# EAGLE design nano_board_v0 (EAGLE 9.6.2)
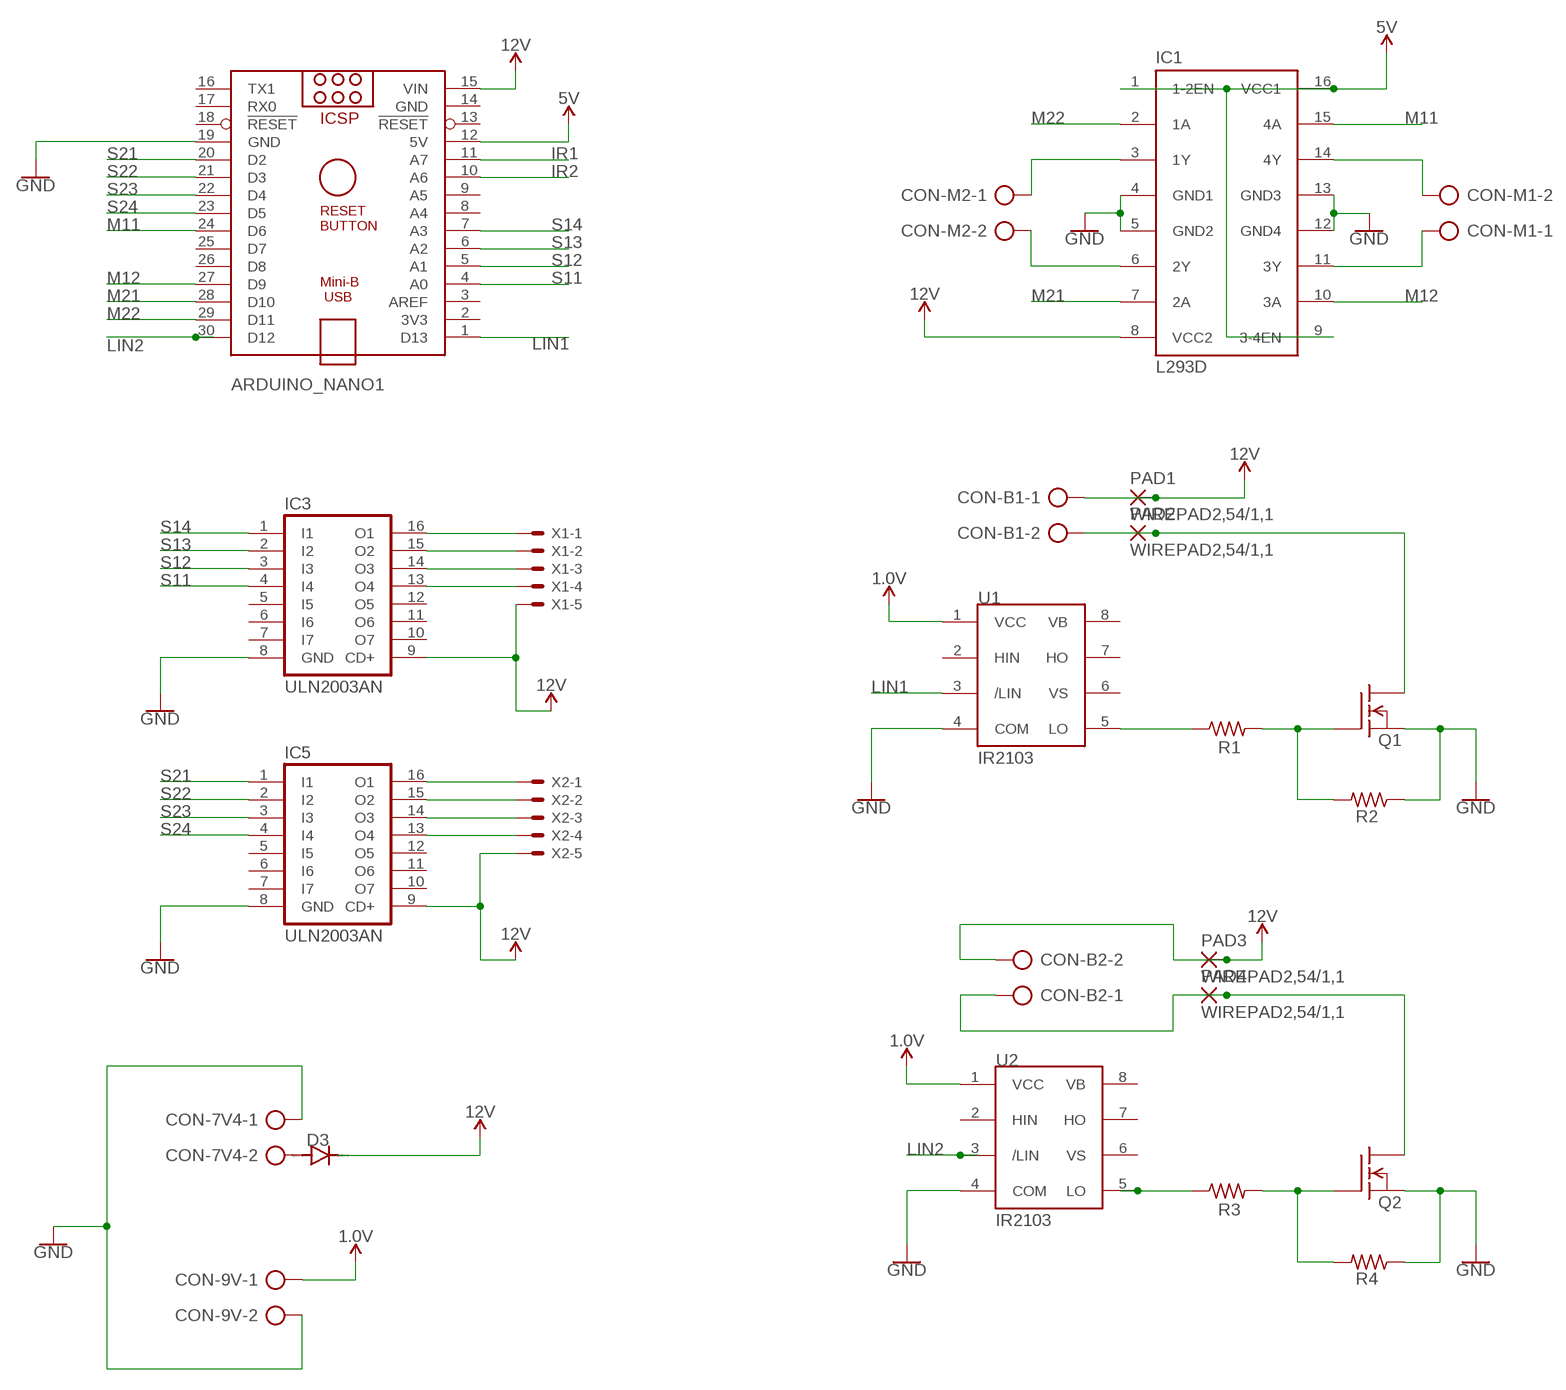
[diagram p0: schematic, sheet 1]

## Parts
ARDUINO_NANO1  ARDUINO_NANO  [ARDUINO_NANO]
CON-7V4  AK500/2  [AK500/2]
CON-9V  AK500/2  [AK500/2]
CON-B1  AK500/2  [AK500/2]
CON-B2  AK500/2  [AK500/2]
CON-M1  AK500/2  [AK500/2]
CON-M2  AK500/2  [AK500/2]
D3  1N4004  [DO41-10]
IC1  L293D  [DIL16]
IC3  ULN2003AN  [DIL16]
IC5  ULN2003AN  [DIL16]
PAD1  WIREPAD2,54/1,1  [2,54/1,1]
PAD2  WIREPAD2,54/1,1  [2,54/1,1]
PAD3  WIREPAD2,54/1,1  [2,54/1,1]
PAD4  WIREPAD2,54/1,1  [2,54/1,1]
Q1  IRF510  [TO220]
Q2  IRF510  [TO220]
R1  R-US_0204/7  [0204/7]
R2  R-US_0204/7  [0204/7]
R3  R-US_0204/7  [0204/7]
R4  R-US_0204/7  [0204/7]
U1  IR2103  [DIL08]
U2  IR2103  [DIL08]
X1  JST-XH-05-PIN-LONG-PAD  [JST-XH-05-PACKAGE-LONG-PAD]
X2  JST-XH-05-PIN-LONG-PAD  [JST-XH-05-PACKAGE-LONG-PAD]

## Nets
1.0V: CON-9V.1 U1.1(VCC) U2.1(VCC)
5V: ARDUINO_NANO1.12(5V) IC1.1(1-2EN) IC1.9(3-4EN) IC1.16(VCC1)
12V: ARDUINO_NANO1.15(VIN) CON-B1.1 CON-B2.2 D3.C IC1.8(VCC2) IC3.9(CD+) IC5.9(CD+) PAD1.1(P) PAD3.1(P) X1.5 X2.5
GND: ARDUINO_NANO1.19(GND) CON-7V4.1 CON-9V.2 IC1.4(GND1) IC1.5(GND2) IC1.12(GND4) IC1.13(GND3) IC3.8(GND) IC5.8(GND) Q1.3(S) Q2.3(S) R2.1 R4.1 U1.4(COM) U2.4(COM)
IR1: ARDUINO_NANO1.11(A7)
IR2: ARDUINO_NANO1.10(A6)
LIN1: ARDUINO_NANO1.1(D13) U1.3(/LIN)
LIN2: ARDUINO_NANO1.30(D12) U2.3(/LIN)
M11: ARDUINO_NANO1.24(D6) IC1.15(4A)
M12: ARDUINO_NANO1.27(D9) IC1.10(3A)
M21: ARDUINO_NANO1.28(D10) IC1.7(2A)
M22: ARDUINO_NANO1.29(D11) IC1.2(1A)
N$1: R1.1 U1.5(LO)
N$2: Q1.1(G) R1.2 R2.2
N$3: R3.1 U2.5(LO)
N$4: IC3.16(O1) X1.1
N$5: IC3.15(O2) X1.2
N$6: CON-M1.2 IC1.14(4Y)
N$7: CON-M1.1 IC1.11(3Y)
N$8: CON-M2.1 IC1.3(1Y)
N$9: CON-M2.2 IC1.6(2Y)
N$10: CON-B1.2 PAD2.1(P) Q1.2(D)
N$11: Q2.1(G) R3.2 R4.2
N$12: IC3.14(O3) X1.3
N$13: IC3.13(O4) X1.4
N$14: IC5.16(O1) X2.1
N$15: IC5.15(O2) X2.2
N$16: CON-B2.1 PAD4.1(P) Q2.2(D)
N$17: CON-7V4.2 D3.A
N$19: IC5.14(O3) X2.3
N$20: IC5.13(O4) X2.4
S11: ARDUINO_NANO1.4(A0) IC3.4(I4)
S12: ARDUINO_NANO1.5(A1) IC3.3(I3)
S13: ARDUINO_NANO1.6(A2) IC3.2(I2)
S14: ARDUINO_NANO1.7(A3) IC3.1(I1)
S21: ARDUINO_NANO1.20(D2) IC5.1(I1)
S22: ARDUINO_NANO1.21(D3) IC5.2(I2)
S23: ARDUINO_NANO1.22(D4) IC5.3(I3)
S24: ARDUINO_NANO1.23(D5) IC5.4(I4)
Unconnected: ARDUINO_NANO1.2(3V3) ARDUINO_NANO1.3(AREF) ARDUINO_NANO1.8(A4) ARDUINO_NANO1.9(A5) ARDUINO_NANO1.13(!RESET) ARDUINO_NANO1.16(TX1) ARDUINO_NANO1.17(RX0) ARDUINO_NANO1.18(!RESET) ARDUINO_NANO1.25(D7) ARDUINO_NANO1.26(D8) IC3.5(I5) IC3.6(I6) IC3.7(I7) IC3.10(O7) IC3.11(O6) IC3.12(O5) IC5.5(I5) IC5.6(I6) IC5.7(I7) IC5.10(O7) IC5.11(O6) IC5.12(O5) U1.2(HIN) U1.6(VS) U1.7(HO) U1.8(VB) U2.2(HIN) U2.6(VS) U2.7(HO) U2.8(VB)

## Power pins joined to a net without a drawn wire
GND: ARDUINO_NANO1.14(GND)

## Library data of the parts
ARDUINO_NANO1 = ArduinoNanoV30:ARDUINO_NANO: Arduino Nano V3.0 Overview: The Arduino Nano is a small, complete, and breadboard-friendly board based on the ATmega328 (Arduino Nano 3.x) or ATmega168 (Arduino Nano 2.x). It has more or less the same functionality of the Arduino Duemilanove, but in a different package. It lacks only a DC power jack, and works with a Mini-B USB cable instead of a standard one. The Nano was designed and is being produced by Gravitech. Specifications: Microcontroller Atmel ATmega168 or ATmega328 Operating Voltage (logic level) 5 V Input Voltage (recommended) 7-12 V Input Voltage (limits) 6-20 V Digital I/O Pins 14 (of which 6 provide PWM output) Analog Input Pins 8 DC Current per I/O Pin 40 mA Flash Memory 16 KB (ATmega168) or 32 KB (ATmega328) of which 2 KB used by bootloader SRAM 1 KB (ATmega168) or 2 KB (ATmega328) EEPROM 512 bytes (ATmega168) or 1 KB (ATmega328) Clock Speed 16 MHz Dimensions 0.73" x 1.70" Length 45 mm Width 18 mm Weigth 5 g Power: The Arduino Nano can be powered via the Mini-B USB connection, 6-20V unregulated external power supply (pin 30), or 5V regulated external power supply (pin 27). The power source is automatically selected to the highest voltage source. Memory: The ATmega168 has 16 KB of flash memory for storing code (of which 2 KB is used for the bootloader); the ATmega328 has 32 KB, (also with 2 KB used for the bootloader). The ATmega168 has 1 KB of SRAM and 512 bytes of EEPROM (which can be read and written with the EEPROM library); the ATmega328 has 2 KB of SRAM and 1 KB of EEPROM. Input and Output: Each of the 14 digital pins on the Nano can be used as an input or output, using pinMode(), digitalWrite(), and digitalRead() functions. They operate at 5 volts. Each pin can provide or receive a maximum of 40 mA and has an internal pull-up resistor (disconnected by default) of 20-50 kOhms. In addition, some pins have specialized functions. Visit Arduino - ArduinoBoardNano <https://www.arduino.cc/en/Main/ArduinoBoardNano>
CON-7V4 CON-9V CON-B1 CON-B2 CON-M1 CON-M2 = con-ptr500:AK500/2: CONNECTOR; OC_FARNELL: unknown; OC_NEWARK: unknown
D3 = diode:1N4004: DIODE general purpose rectifier, 1 A
IC1 = st-microelectronics:L293D: PUSH-PULL 4 CHANNEL DRIVER; MPN: L293D; OC_FARNELL: 9589619; OC_NEWARK: 56P8249
IC3 IC5 = uln-udn:ULN2003A: DRIVER ARRAY
PAD1-PAD4 = wirepad:WIREPAD: Wire PAD connect wire on PCB
Q1 Q2 = transistor-fet:IRF510: N-Channel Enhancement MOSFET (HEXFET); 100V; 5,6A; 0,54Ohm
R1-R4 = rcl:R-US_: RESISTOR, American symbol; SPICEPREFIX: R
U1 U2 = irf:IR2103: High and low side driver
X1 X2 = JST XH Connectors v1-0:JST-XH-05-PIN: JST XH Connector 2 Pin Wire to board connector. Pitch: 2,54 mm, (0.100") Number of pins: 5 Created by Rembrandt Electronics www.rembrandtelectronics.com

## Board
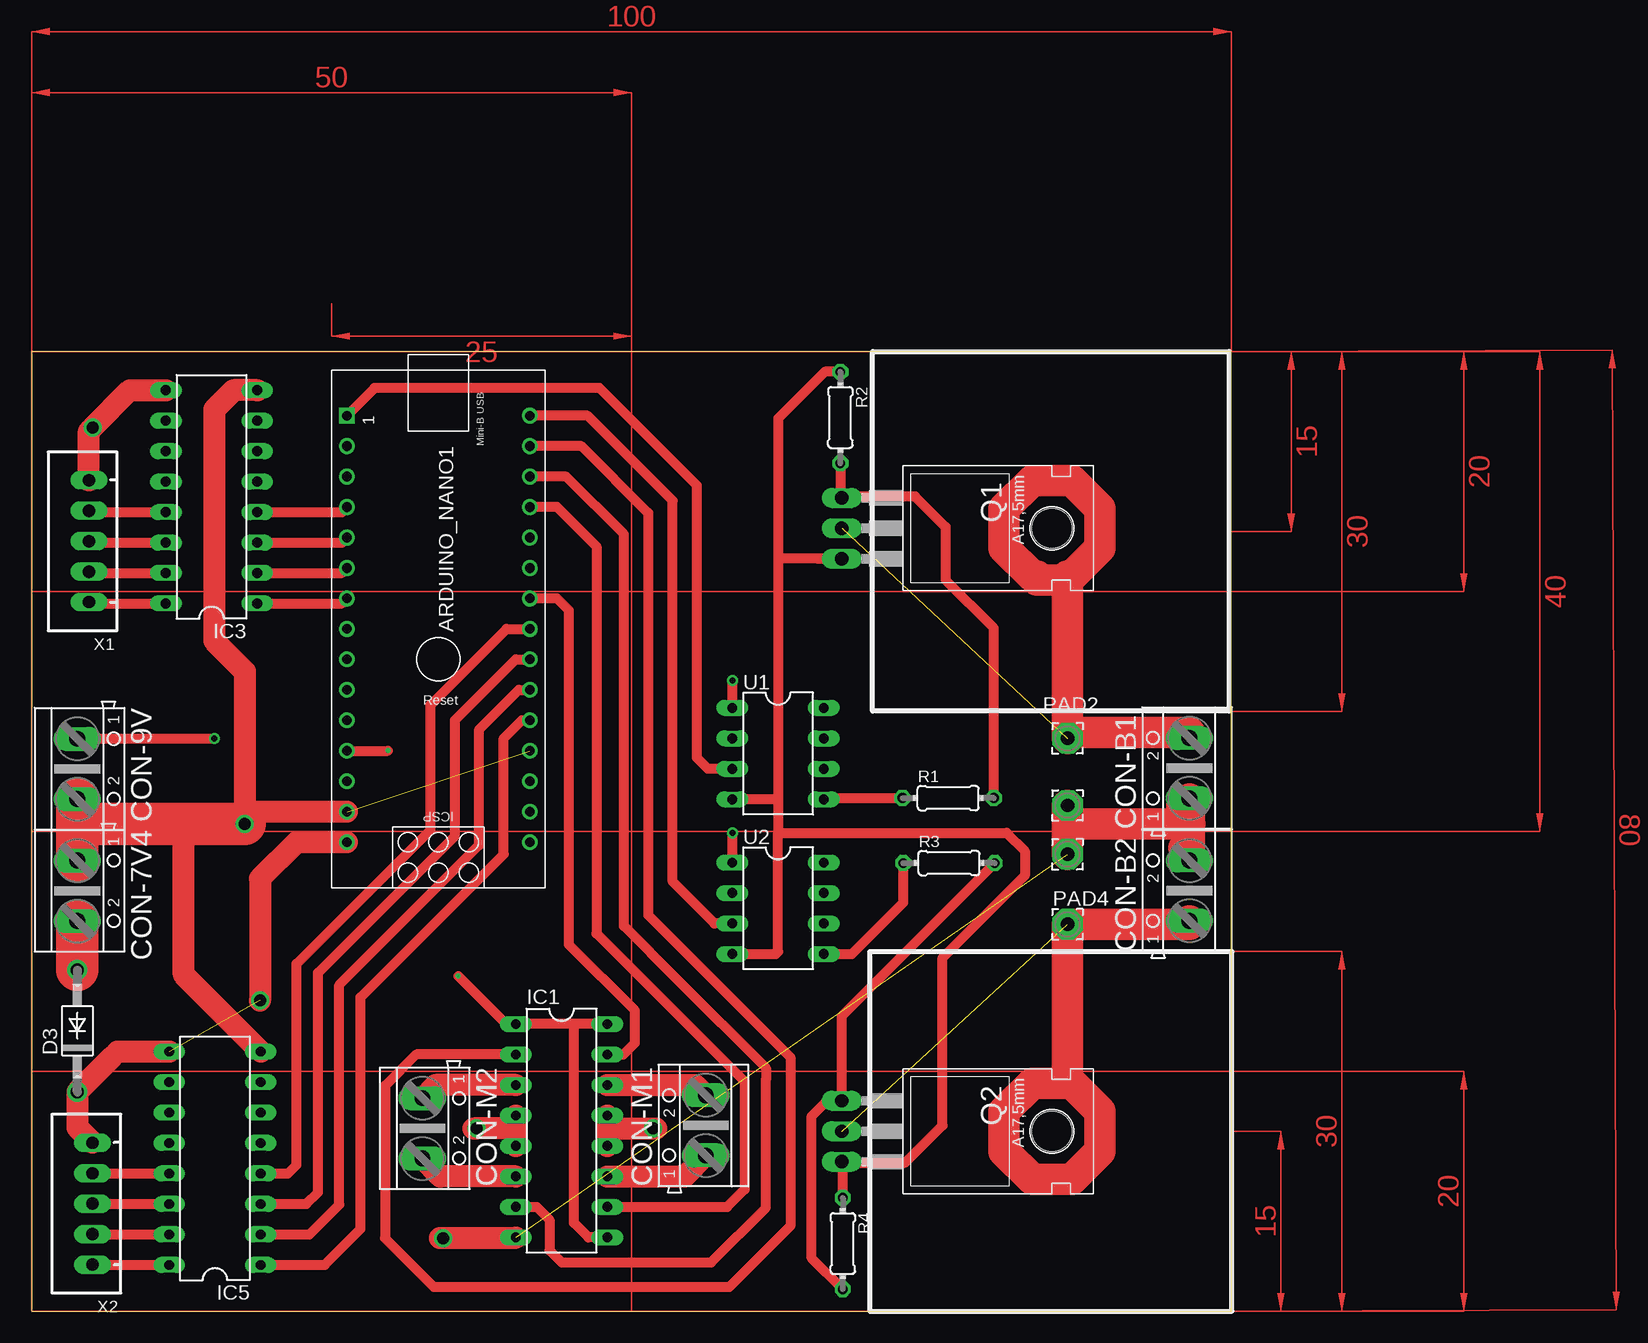
[diagram p1: board, top side]
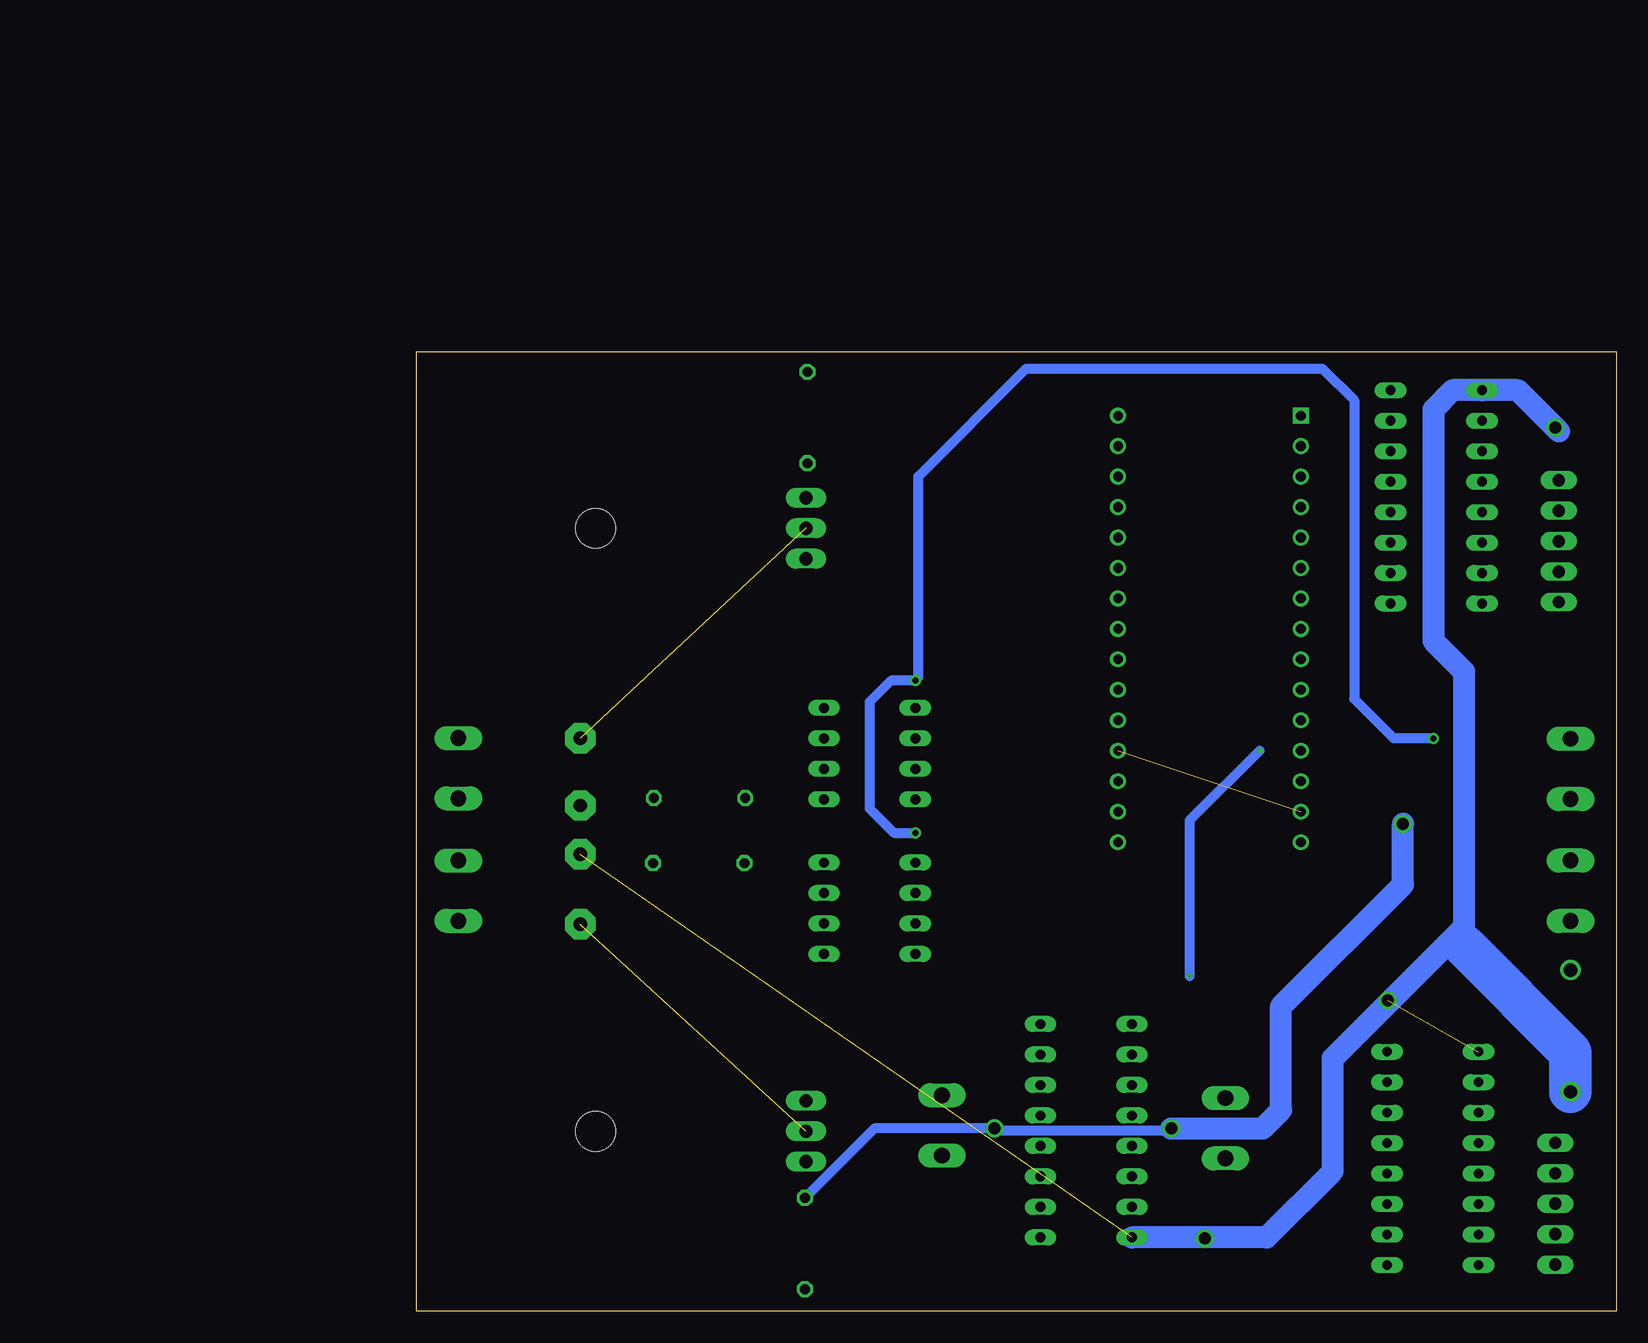
[diagram p2: board, bottom side, seen from below]

Size 100 x 80 mm. Coordinates in mm from the lower left corner, seen from the top.
Outline: 0,0 100,0 100,80 0,80 0,0
Copper layers (1*16): Top 0.035mm / dielectric 1.5mm / Bottom 0.035mm
Design rules "default": minimum track width 6mil, minimum drill 0.35mm, track to track 6mil, track to pad 6mil, pad to pad 6mil, via to via 6mil, smd to smd 6mil, copper to edge 40mil, drill to drill 6mil, minimum pad ring 10mil, minimum via ring 8mil, stop-mask expansion 4mil, vias tented up to drill 0mil, thermal gap 10mil

### Footprints (pad centres in the part's own frame; a part is rotated, then mirrored left to right if it is on the bottom)
ARDUINO_NANO = drill 0.8 square: 1 -20.32,-7.62 | drill 0.8: 2 -17.78,-7.62; 3 -15.24,-7.62; 4 -12.7,-7.62; 5 -10.16,-7.62; 6 -7.62,-7.62; 7 -5.08,-7.62; 8 -2.54,-7.62; 9 0,-7.62; 10 2.54,-7.62; 11 5.08,-7.62; 12 7.62,-7.62; 13 10.16,-7.62; 14 12.7,-7.62; 15 15.24,-7.62; 16 15.24,7.62; 17 12.7,7.62; 18 10.16,7.62; 19 7.62,7.62; 20 5.08,7.62; 21 2.54,7.62; 22 0,7.62; 23 -2.54,7.62; 24 -5.08,7.62; 25 -7.62,7.62; 26 -10.16,7.62; 27 -12.7,7.62; 28 -15.24,7.62; 29 -17.78,7.62; 30 -20.32,7.62
AK500/2 = drill 1.321 long: 1 -2.515,0; 2 2.515,0
DO41-10 = drill 1.118: A 5.08,0; C -5.08,0
DIL16 = drill 0.813 long: 1 -8.89,-3.81; 2 -6.35,-3.81; 3 -3.81,-3.81; 4 -1.27,-3.81; 5 1.27,-3.81; 6 3.81,-3.81; 7 6.35,-3.81; 8 8.89,-3.81; 9 8.89,3.81; 10 6.35,3.81; 11 3.81,3.81; 12 1.27,3.81; 13 -1.27,3.81; 14 -3.81,3.81; 15 -6.35,3.81; 16 -8.89,3.81
2,54/1,1 = drill 1.118 pad 2.54 octagon: 1 0,0
TO220 = drill 1.118 long: 1 -2.54,-6.35; 2 0,-6.35; 3 2.54,-6.35 | hole 3.302: 0,11.176
0204/7 = drill 0.813 octagon: 1 -3.81,0; 2 3.81,0
DIL08 = drill 0.813 long: 1 -3.81,-3.81; 2 -1.27,-3.81; 3 1.27,-3.81; 4 3.81,-3.81; 5 3.81,3.81; 6 1.27,3.81; 7 -1.27,3.81; 8 -3.81,3.81
JST-XH-05-PACKAGE-LONG-PAD = drill 1.016 long: 1 -5.08,0; 2 -2.54,0; 3 0,0; 4 2.54,0; 5 5.08,0

### Placement (x,y rotation side)
ARDUINO_NANO1  33.91,54.34 270 top
CON-7V4  3.81,35.05 270 top
CON-9V  3.81,45.21 270 top
CON-B1  96.52,45.27 90 top
CON-B2  96.52,35.06 90 top
CON-M1  56.2,15.49 90 top
CON-M2  32.58,15.25 270 top
D3  3.81,23.37 90 top
IC1  44.18,15.05 270 top
IC3  15,67.89 90 top
IC5  15.29,12.75 90 top
PAD1  86.36,42.16 0 top
PAD2  86.36,47.75 0 top
PAD3  86.36,38.1 0 top
PAD4  86.36,32.26 0 top
Q1  73.89,65.27 270 top
Q2  73.89,15 270 top
R1  76.41,42.78 0 top
R2  67.42,74.5 270 top
R3  76.48,37.36 0 top
R4  67.62,5.64 270 top
U1  62.23,46.48 270 top
U2  62.23,33.59 270 top
X1  4.78,64.19 90 top
X2  5.08,8.97 90 top

### Tracks (layer width: path | path; a pad name or v marks a point on that pad's centre or on a via)
1.0V  (via drill 0.5)
  Top 0.813: U2.1 v58.42,39.88 | U1.1 v58.42,52.58 | CON-9V.1 3.83,47.75 v15.24,47.75
  Bottom 0.813: 58.48,37.34 U2.1 | v15.24,47.75 18.54,47.75 21.84,51.05 21.84,75.95 24.48,78.58 49.18,78.58 58.17,69.6 58.17,52.83 v58.42,52.58 60.45,52.58 62.23,50.8 62.23,41.91 60.2,39.88 v58.42,39.88
5V  (via drill 0.01)
  Top 0.813: IC1.16 45.21,23.94 | 45.21,23.94 IC1.1 39.56,23.94 v35.56,27.94 | IC1.9 46.42,6.16 45.21,7.37 45.21,23.94 | ARDUINO_NANO1.12 29.7,46.72 v29.72,46.74
  Bottom 0.813: v29.72,46.74 35.56,40.89 v35.56,27.94
12V  (via drill 1)  (2 unrouted)
  Top 1.626: 96.55,38.1 CON-B2.2 | 7.16,21.64 6.73,21.21
  Top 1.829: X1.5 4.78,73.36 v5.08,73.66 8.2,76.78 IC3.9 | IC1.8 40.31,6.1 v34.29,6.1 34.04,6.1 | IC5.9 7.16,21.64 | 6.73,21.21 D3.C 3.81,15.32 X2.5 | ARDUINO_NANO1.15 22.08,39.1 19.05,36.07 v19.05,25.91
  Top 2.54: 95.85,42.16 CON-B1.1 96.55,42.64 96.55,40.64 96.55,38.1 96.03,38.62
  Top 2.642: 96.55,40.64 86.36,40.64 PAD1.1 PAD3.1
  Bottom 1.829: 4.78,73.36 v5.08,73.66 8.2,76.78 IC3.9 13.64,76.78 15.24,75.18 15.24,55.88 12.7,53.34 12.7,32 | IC1.8 29.15,6.16 23.62,11.68 23.62,21.08 12.7,32 | 12.7,32 12.7,30.48
  Bottom 3.556: D3.C 3.81,21.59 12.7,30.48
GND  (via drill 1)  (1 unrouted)
  Top 0.813: CON-9V.2 3.81,41.66 | 3.81,41.66 3.81,40.64 | 3.83,41.64 3.81,41.66 | R2.1 66.12,78.31 62.23,74.42 62.23,62.74 | 65.54,62.73 Q1.3 62.24,62.73 62.23,62.74 | R4.1 67.62,12.38 | 67.62,12.38 Q2.3 | 62.23,62.74 62.23,42.67 | 62.23,42.67 62.23,39.88 | 62.23,39.88 62.23,29.97 62.04,29.78 U2.4 | 62.23,42.67 U1.4 | 67.62,12.38 72.83,12.38 75.95,15.49 75.95,29.46 82.8,36.32 82.8,38.35 81.28,39.88 62.23,39.88
  Top 1.626: 17.8,41.64 17.78,41.66
  Top 1.829: IC1.13 47.99,15.24 | 47.99,15.24 IC1.12 | IC1.4 40.37,15.24 | 40.37,15.24 IC1.5 | 47.99,15.24 v51.82,15.24 52.07,15.24 | 40.37,15.24 v37.08,15.24 36.83,15.24 | IC3.8 16.84,76.78 15.24,75.18 15.24,55.88 17.78,53.34 17.78,41.66 v17.78,40.64 18.78,41.64 ARDUINO_NANO1.14 | IC5.8 12.7,28.04 12.7,40.64
  Top 3.556: CON-7V4.1 3.81,40.64 | 3.81,40.64 CON-9V.2 | 3.81,40.64 12.7,40.64 v17.78,40.64
  Bottom 0.813: R4.1 61.84,15.24 v51.82,15.24 51.64,15.06 37.26,15.06 v37.08,15.24
  Bottom 1.829: v17.78,40.64 17.78,35.56 27.94,25.4 27.94,16.76 29.46,15.24 v37.08,15.24
LIN1
  Top 0.813: ARDUINO_NANO1.1 28.59,76.96 47.34,76.96 55.47,68.83 55.47,46.13 56.39,45.21 U1.3
LIN2
  Top 0.813: U2.3 56.93,32.32 53.44,35.81 53.44,67.56 46.34,74.66 ARDUINO_NANO1.30
M11
  Top 0.813: ARDUINO_NANO1.24 43.8,59.42 44.8,58.42 44.8,30.56 50.29,25.07 50.29,22.35 49.34,21.4 IC1.15
M12
  Top 0.813: IC1.10 57.98,8.7 59.44,10.16 59.44,19.15 47.09,31.5 47.09,63.75 43.8,67.04 ARDUINO_NANO1.27
M21
  Top 0.813: IC1.7 42.1,8.7 43.18,7.62 43.18,5.08 44.2,4.06 56.64,4.06 61.21,8.64 61.21,19.3 61.21,20.27 53.82,27.66 49.37,32.11 49.37,64.77 44.56,69.58 ARDUINO_NANO1.28
M22
  Top 0.813: ARDUINO_NANO1.29 45.83,72.12 51.4,66.55 51.4,33.02 63.25,21.18 63.25,7.11 58.17,2.03 33.53,2.03 29.46,6.1 29.46,18.8 32.07,21.4 IC1.2
N$1
  Top 0.813: U1.5 66.15,42.78 R1.1
N$2
  Top 0.813: R2.2 67.42,67.93 | 67.42,67.93 Q1.1 | 67.42,67.93 73.66,67.93 76.2,65.39 76.2,60.96 80.22,56.94 R1.2
N$3
  Top 0.813: 66.2,29.95 U2.5 68.39,29.78 72.67,34.06 R3.1
N$4
  Top 0.813: X1.1 4.89,59 IC3.16
N$5
  Top 0.813: X1.2 4.89,61.54 IC3.15
N$6
  Top 1.829: IC1.14 55.35,18.86 CON-M1.2
N$7
  Top 1.829: IC1.11 54.46,11.24 CON-M1.1
N$8
  Top 1.829: IC1.3 33.67,18.86 CON-M2.1
N$9
  Top 1.829: IC1.6 34.08,11.24 CON-M2.2
N$10  (1 unrouted)
  Top 1.626: 96.52,48.26 CON-B1.2
  Top 2.642: 96.52,48.26 86.36,48.26 PAD2.1 86.36,60.96 | 86.36,60.96 86.36,61.28 86.72,61.28 89.05,63.62 89.05,66.92 86.72,69.26 83.41,69.26 81.08,66.92 81.08,63.62 83.41,61.28 83.82,61.28 83.82,60.96 86.36,60.96
N$11
  Top 0.813: R4.2 65.02,4.43 65.02,16.26 66.31,17.54 Q2.1 67.54,24.61 R3.2
N$12
  Top 0.813: X1.3 4.89,64.08 IC3.14
N$13
  Top 0.813: X1.4 4.89,66.62 IC3.13
N$14
  Top 0.813: X2.1 11.45,3.89 IC5.16
N$15
  Top 0.813: X2.2 5.11,6.4 IC5.15
N$16  (1 unrouted)
  Top 2.642: CON-B2.1 96.52,32.26 PAD4.1 86.36,18.99 | 86.36,18.99 86.72,18.99 89.05,16.65 89.05,13.35 86.72,11.01 83.41,11.01 81.08,13.35 81.08,16.65 83.41,18.99 84.07,18.99 86.36,18.99
N$17
  Top 3.556: CON-7V4.2 D3.A
N$19
  Top 0.813: X2.3 5.11,8.94 IC5.14
N$20
  Top 0.813: X2.4 11.45,11.51 IC5.13
S11
  Top 0.813: IC3.4 25.87,66.62 ARDUINO_NANO1.4
S12
  Top 0.813: IC3.3 25.87,64.08 ARDUINO_NANO1.5
S13
  Top 0.813: IC3.2 25.87,61.54 ARDUINO_NANO1.6
S14
  Top 0.813: IC3.1 25.87,59 ARDUINO_NANO1.7
S21
  Top 0.813: IC5.1 24.43,3.86 27.43,6.86 27.43,26.18 39.35,38.1 39.35,47.75 40.86,49.26 ARDUINO_NANO1.20
S22
  Top 0.813: IC5.2 23.16,6.4 25.65,8.89 25.65,27.19 37.32,38.86 37.32,48.51 40.61,51.8 ARDUINO_NANO1.21
S23
  Top 0.813: IC5.3 22.91,8.94 23.88,9.91 23.88,28.21 35.29,39.62 35.29,49.28 40.35,54.34 ARDUINO_NANO1.22
S24
  Top 0.813: IC5.4 21.39,11.48 22.1,12.19 22.1,28.97 33.26,40.13 33.26,50.55 39.59,56.88 ARDUINO_NANO1.23
(copper drawn outside any net)
  shapes: Top area x13